# EAGLE design Touch_Shield-v20 (EAGLE 6.2)
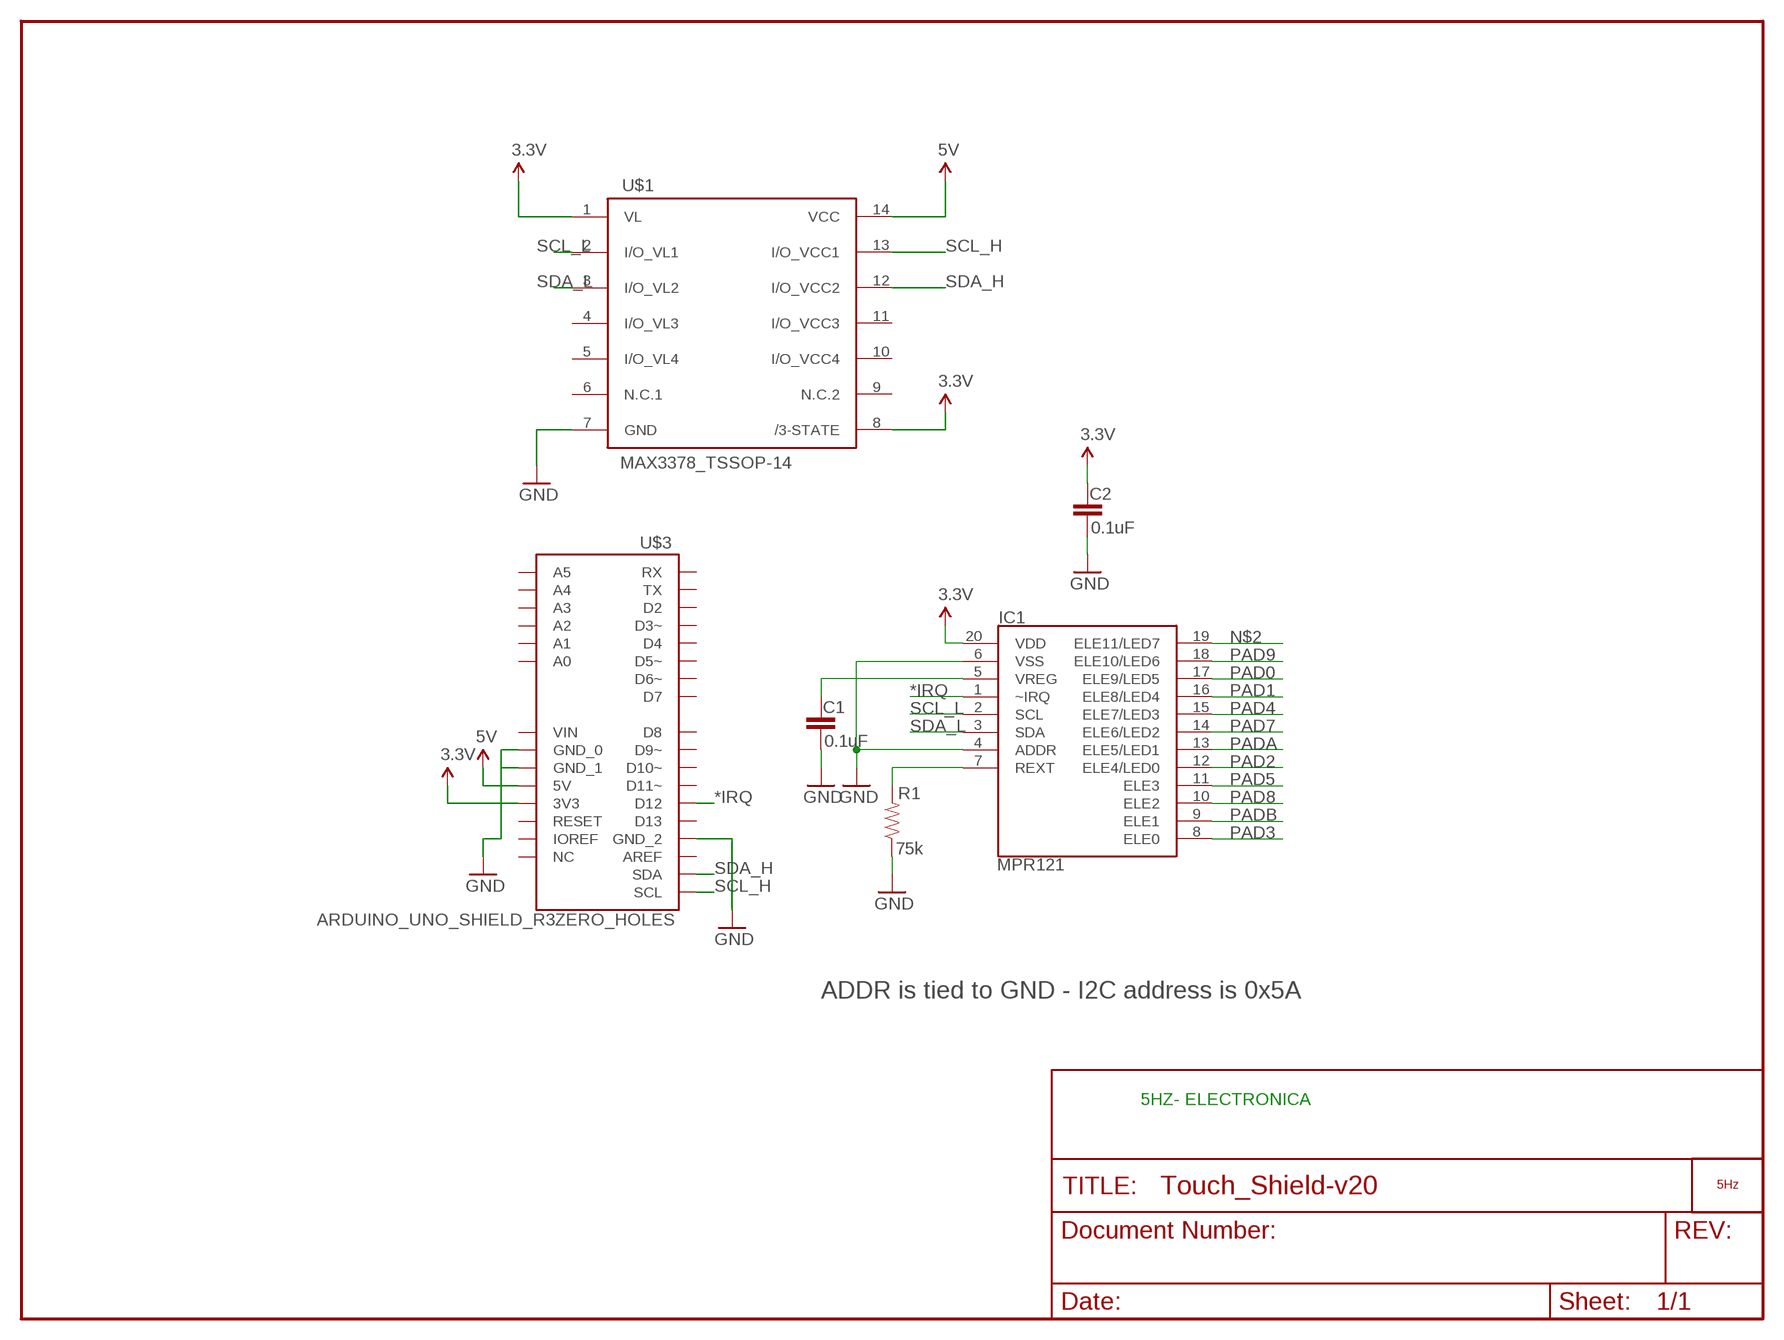
[diagram p0: schematic, sheet 1]

## Parts
C1  0.1uF  CAP0402-CAP  [0402-CAP]
C2  0.1uF  CAP0402-CAP  [0402-CAP]
IC1  MPR121  MPR121QFN20  [QFN-20-0.4MM]
LOGO1  LOGO_5HZ_H_10MM  [5HZ_LOGO_H_10MM]
R1  75k  RESISTOR0402-RES  [0402-RES]
U$1  MAX3378_TSSOP-14  [TSSOP14]
U$3  ARDUINO_UNO_SHIELD_R3ZERO_HOLES  [UNO_R3_SHIELD_NO_SILK]

## Nets
3.3V: C2.1 IC1.20(VDD) U$1.1(VL) U$1.8(/3-STATE) U$3.3.3V(3V3)
5V: U$1.14(VCC) U$3.5V
*IRQ: IC1.1(~IRQ) U$3.D12
GND: C1.2 C2.2 IC1.4(ADDR) IC1.6(VSS) R1.1 U$1.7(GND) U$3.GND_0 U$3.GND_1 U$3.GND_2
N$2: IC1.19(ELE11/LED7)
PAD0: IC1.17(ELE9/LED5)
PAD1: IC1.16(ELE8/LED4)
PAD2: IC1.12(ELE4/LED0)
PAD3: IC1.8(ELE0)
PAD4: IC1.15(ELE7/LED3)
PAD5: IC1.11(ELE3)
PAD7: IC1.14(ELE6/LED2)
PAD8: IC1.10(ELE2)
PAD9: IC1.18(ELE10/LED6)
PADA: IC1.13(ELE5/LED1)
PADB: IC1.9(ELE1)
REXT: IC1.7(REXT) R1.2
SCL_H: U$1.13(I/O_VCC1) U$3.SCL
SCL_L: IC1.2(SCL) U$1.2(I/O_VL1)
SDA_H: U$1.12(I/O_VCC2) U$3.SDA
SDA_L: IC1.3(SDA) U$1.3(I/O_VL2)
VREG: C1.1 IC1.5(VREG)
Unconnected: U$1.4(I/O_VL3) U$1.5(I/O_VL4) U$1.6(N.C.1) U$1.9(N.C.2) U$1.10(I/O_VCC4) U$1.11(I/O_VCC3) U$3.A0 U$3.A1 U$3.A2 U$3.A3 U$3.A4 U$3.A5 U$3.AREF U$3.D2 U$3.D3(D3~) U$3.D4 U$3.D5(D5~) U$3.D6(D6~) U$3.D7 U$3.D8 U$3.D9(D9~) U$3.D10(D10~) U$3.D11(D11~) U$3.D13 U$3.IOREF U$3.NC U$3.RES(RESET) U$3.RX U$3.TX U$3.VIN

## Notes on the sheet
- ADDR is tied to GND - I2C address is 0x5A
- 5HZ- ELECTRONICA

## Library data of the parts
C1 C2 = SparkFun:CAP: Capacitor Standard 0603 ceramic capacitor, and 0.1" leaded capacitor.
IC1 = SparkFun:MPR121: MPR121 Capacitive Touch Sensor Controller
LOGO1 = 5hz-electronica:LOGO_5HZ: Logotipo 5Hz "según Pedro"
R1 = SparkFun:RESISTOR: Resistor Basic schematic elements and footprints for 0603, 1206, and PTH resistors.
U$1 = 5hz-electronica:MAX3378
U$3 = 5hz-electronica:ARDUINO_UNO_SHIELD_R3

## Board
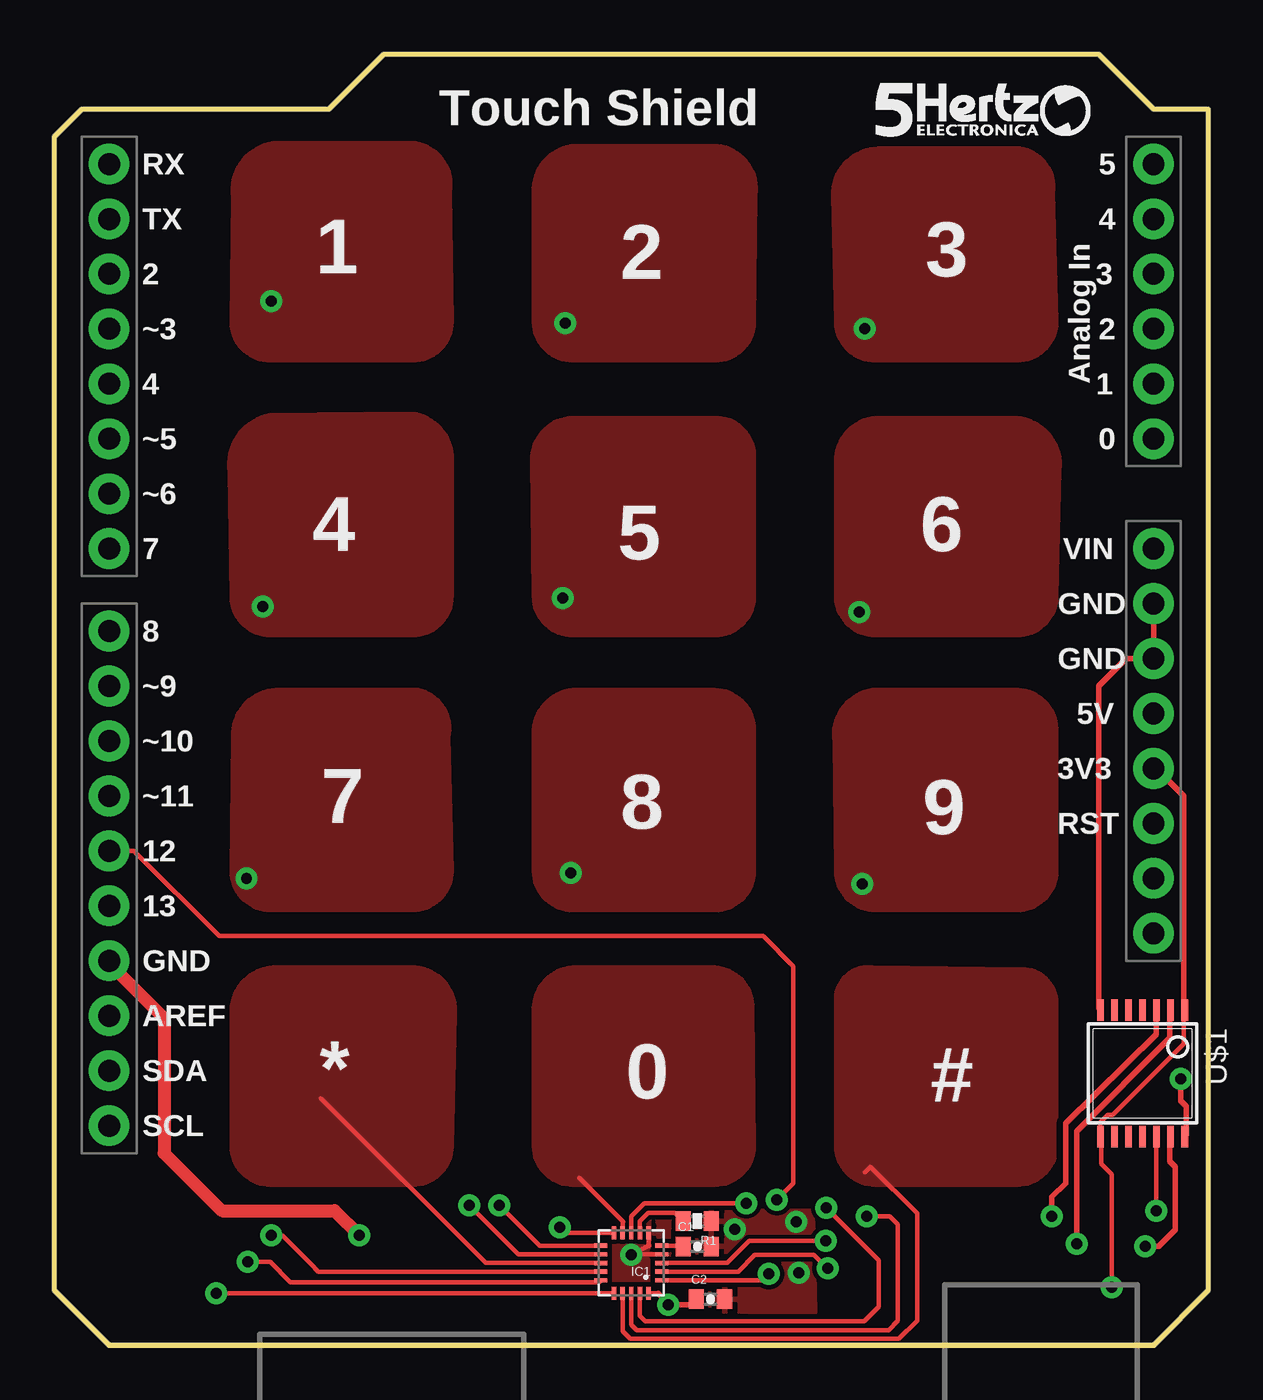
[diagram p1: board, top side]
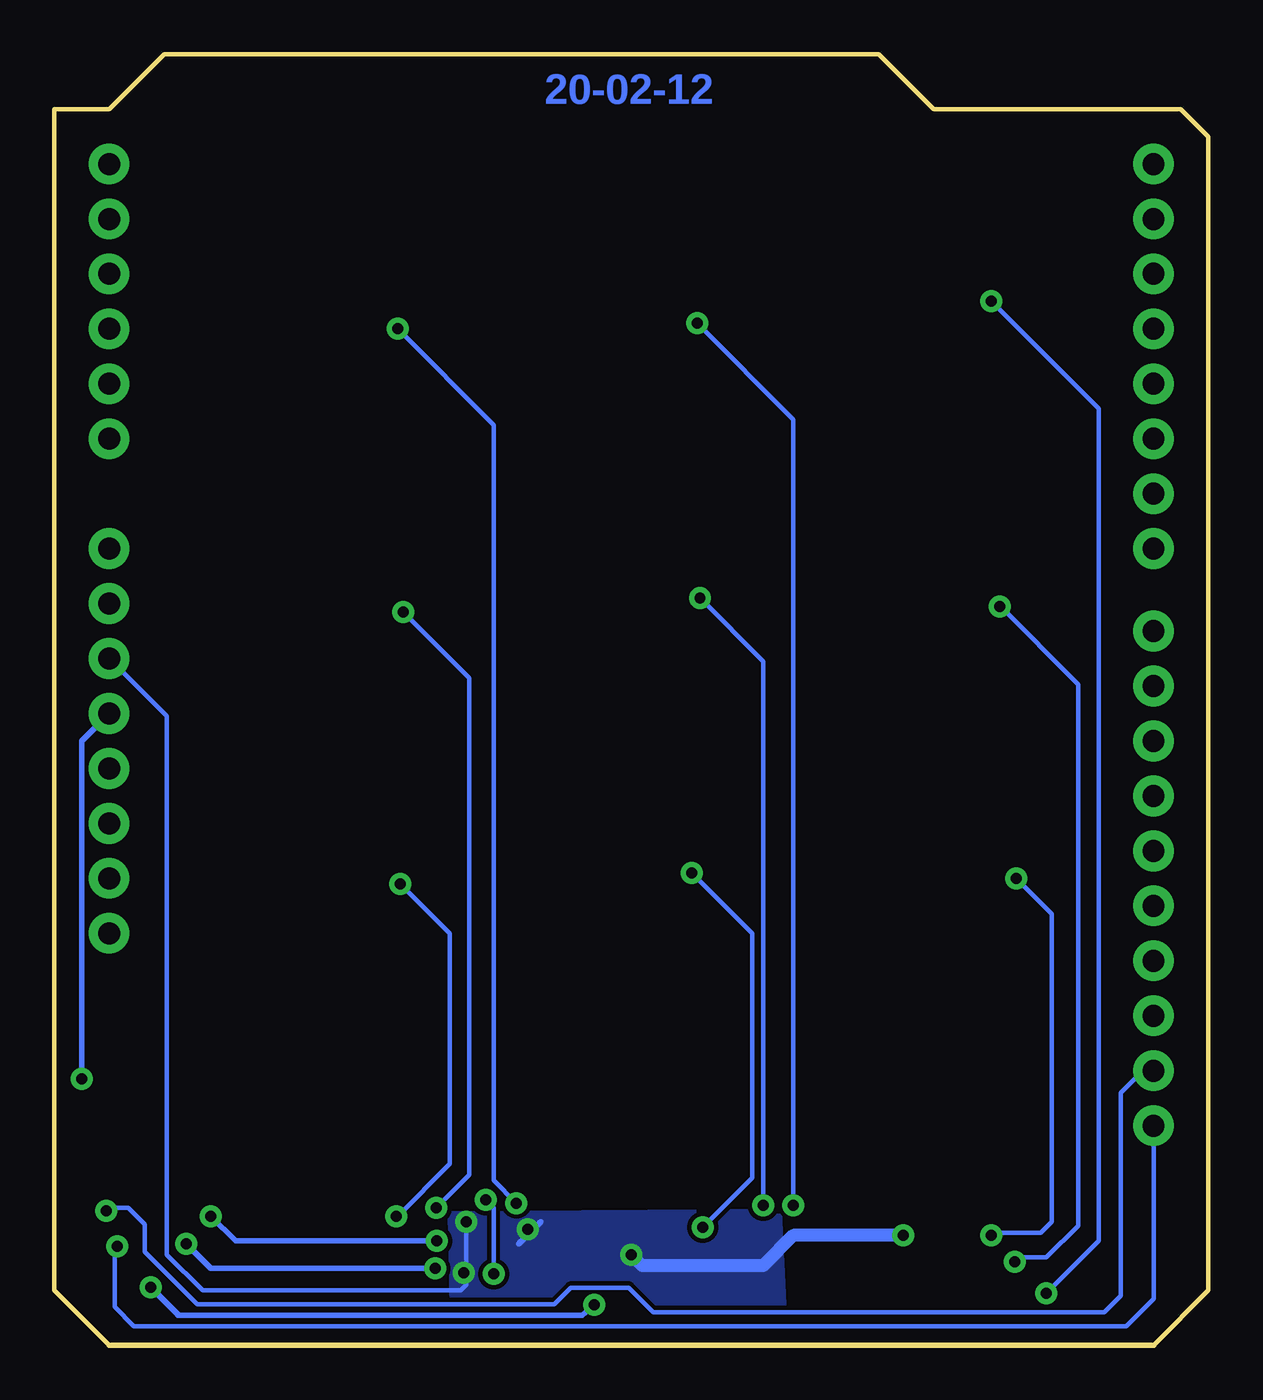
[diagram p2: board, bottom side, seen from below]

Size 53.34 x 59.69 mm. Coordinates in mm from the lower left corner, seen from the top.
Outline: 2.54,0 0,2.54 0,55.88 1.27,57.15 12.7,57.15 15.24,59.69 48.26,59.69 50.8,57.15 53.34,57.15 53.34,2.54 50.8,0 2.54,0
Copper layers (1*16): Top 0.035mm / dielectric 1.5mm / Bottom 0.035mm
Design rules: minimum track width 8mil, minimum drill 20mil, track to track 8mil, track to pad 8mil, pad to pad 8mil, via to via 8mil, smd to smd 8mil, copper to edge 10mil, drill to drill 8mil, minimum pad ring 12mil, minimum via ring 10mil, stop-mask expansion 4mil, vias tented up to drill 25mil, thermal gap 10mil

### Footprints (pad centres in the part's own frame; a part is rotated, then mirrored left to right if it is on the bottom)
0402-CAP = smd 0.7 x 0.9: 1 -0.65,0; 2 0.65,0
QFN-20-0.4MM = smd 0.6 x 0.2: 1 -1.4,0.8; 2 -1.4,0.4; 3 -1.4,0; 4 -1.4,-0.4; 5 -1.4,-0.8; 11 1.4,-0.8; 12 1.4,-0.4; 13 1.4,0; 14 1.4,0.4; 15 1.4,0.8 | smd 0.2 x 0.6: 6 -0.8,-1.4; 7 -0.4,-1.4; 8 0,-1.4; 9 0.4,-1.4; 10 0.8,-1.4; 16 0.8,1.4; 17 0.4,1.4; 18 0,1.4; 19 -0.4,1.4; 20 -0.8,1.4
0402-RES = smd 0.7 x 0.9: 1 -0.65,0; 2 0.65,0
TSSOP14 = smd 0.305 x 0.991: 1 -1.95,-2.918; 2 -1.3,-2.918; 3 -0.65,-2.918; 4 0,-2.918; 5 0.65,-2.918; 6 1.3,-2.918; 7 1.95,-2.918; 8 1.95,2.918; 9 1.3,2.918; 10 0.65,2.918; 11 0,2.918; 12 -0.65,2.918; 13 -1.3,2.918; 14 -1.95,2.918
UNO_R3_SHIELD_NO_SILK = drill 1.016 pad 1.88: 3.3V 26.67,2.54; 5V 29.21,2.54; A0 41.91,2.54; A1 44.45,2.54; A2 46.99,2.54; A3 49.53,2.54; A4 52.07,2.54; A5 54.61,2.54; AREF 15.24,50.8; D2 49.53,50.8; D3 46.99,50.8; D4 44.45,50.8; D5 41.91,50.8; D6 39.37,50.8; D7 36.83,50.8; D8 33.02,50.8; D9 30.48,50.8; D10 27.94,50.8; D11 25.4,50.8; D12 22.86,50.8; D13 20.32,50.8; GND_0 34.29,2.54; GND_1 31.75,2.54; GND_2 17.78,50.8; IOREF 21.59,2.54; NC 19.05,2.54; RES 24.13,2.54; RX 54.61,50.8; SCL 10.16,50.8; SDA 12.7,50.8; TX 52.07,50.8; VIN 36.83,2.54

### Placement (x,y rotation side)
C1  29.72,4.57 0 top
C2  30.33,2.13 0 top
IC1  26.67,3.81 180 top
LOGO1  37.97,55.88 0 top
R1  29.72,5.74 180 top
U$1  50.29,12.57 180 top
U$3  53.34,0 90 top

### Tracks (layer width: path | path; a pad name or v marks a point on that pad's centre or on a via)
3.3V  (via drill 0.51)
  Top 0.203: v48.87,2.69 48.87,7.9 48.39,8.38 48.39,9.61 U$1.8 48.34,10.32 48.69,10.67 48.92,10.67 52.2,13.95 52.2,15.45 U$1.1 | IC1.20 27.92,2.41
  Top 0.254: U$3.3.3V 50.93,26.67 52.2,25.4 52.2,15.54 U$1.1 | 27.92,2.41 v28.37,1.88 29.42,1.88 C2.1
  Bottom 0.203: 47.62,1.4 47.62,1.45
  Bottom 0.254: 47.62,1.4 28.93,1.4 v28.37,1.88 | 47.62,1.45 v48.87,2.69
5V  (via drill 0.51)
  Top 0.254: v52.07,12.32 52.07,11.3 52.32,11.05 52.32,9.74 U$1.14
  Bottom 0.254: U$3.5V 52.07,27.94 v52.07,12.32
*IRQ  (via drill 0.51)
  Top 0.203: U$3.D12 3.68,22.86 7.62,18.92 32.77,18.92 34.16,17.53 34.16,7.49 v33.4,6.73 | IC1.1 32.73,3.01 v33.02,3.3
  Bottom 0.203: v33.02,3.3 33.02,6.35 v33.4,6.73
GND  (via drill 0.51)
  Top 0.203: 27.07,4.21 IC1.4 | 27.47,4.61 IC1.6
  Top 0.254: U$3.GND_0 U$3.GND_1 49.53,31.75 48.26,30.48 48.26,15.57 U$1.7 | 27.07,4.21 v26.67,4.19 27.47,4.61
  Top 0.61: U$3.GND_2 2.54,17.65 5.08,15.11 5.08,8.89 7.75,6.22 12.95,6.22 v14.1,5.08
  Bottom 0.203: v34.29,5.71 34.29,2.79 34.54,2.54 46.48,2.54 48.13,4.19 48.13,29.08 U$3.GND_1
  Bottom 0.254: 30.86,5.71 31.88,4.7
  Bottom 0.61: v14.1,5.08 19.18,5.08 20.57,3.68 26.16,3.68 v26.67,4.19
  other vias: 31.45,5.36 34.42,3.35
  pour Top: 19.94,6.22 35.05,6.22 35.18,1.52 19.68,1.65
  pour Bottom: 19.81,6.22 35.05,6.1 34.98,1.75 19.61,1.88
PAD0
  Top 0.203: 37.47,8 37.72,8.26 39.88,6.1 39.88,1.14 39.04,0.3 26.62,0.3 26.27,0.65 IC1.17
  pour Top (isolate 0.305): 36.14,9.23 arc90 37.94,7.43 44.51,7.43 arc90 46.3,9.23 46.3,15.82 arc90 44.74,17.39 37.81,17.47 arc90 36.14,16.2
PAD1  (via drill 0.51)
  Top 0.203: IC1.16 v7.5,2.41 v7.49,2.41
  Bottom 0.203: v7.49,2.41 5.08,4.83 5.08,43.31 v10.03,48.26
  pour Top (isolate 0.305): 8.2,47.33 arc90 10,45.53 16.57,45.53 arc90 18.36,47.33 18.29,53.31 arc90 16.69,55.57 10.13,55.57 arc90 8.28,53.08
PAD2  (via drill 0.51)
  Top 0.203: IC1.12 21.44,4.21 v19.18,6.48
  Bottom 0.203: v19.18,6.48 19.18,42.8 v23.62,47.24
  pour Top (isolate 0.305): 22.17,47.33 arc90 23.97,45.53 30.54,45.53 arc90 32.33,47.33 32.41,53.16 arc90 30.66,55.44 24.1,55.44 arc90 22.17,53.31
PAD3  (via drill 0.51)
  Top 0.203: IC1.8 26.67,5.97 27.28,6.58 v31.98,6.58
  Bottom 0.203: v31.98,6.58 33.02,7.62 33.02,42.55 v37.47,46.99
  pour Top (isolate 0.305): 36.14,47.33 arc90 37.94,45.53 44.51,45.53 arc90 46.3,47.33 46.15,53.31 arc90 44.63,55.31 38.07,55.31 arc90 35.99,53.16
PAD4  (via drill 0.51)
  Top 0.203: 25.15,2.97 25.23,2.97 IC1.15 25.18,2.92 10.92,2.92 9.98,3.86 v8.94,3.86
  Bottom 0.203: v8.94,3.86 8.74,4.06 7.49,4.06 6.02,5.54 6.02,30.56 9.68,34.21 9.68,34.19 v9.65,34.16
  pour Top (isolate 0.305): 8.2,34.63 arc90 10,32.83 16.57,32.83 arc90 18.36,34.63 18.36,40.77 arc90 16.49,43.07 10,42.99 arc90 8.13,40.38
PAD5  (via drill 0.51)
  Top 0.203: IC1.11 22.44,4.61 v20.57,6.48
  Bottom 0.203: v20.57,6.48 20.57,31.62 v23.5,34.54
  pour Top (isolate 0.305): 22.17,34.63 arc90 23.97,32.83 30.54,32.83 arc90 32.33,34.63 32.33,41.15 arc90 30.54,42.87 23.97,42.87 arc90 22.1,40.92
PAD6  (via drill 0.51)
  Top 0.203: v35.69,6.35 38.1,3.94 38.1,1.78 37.44,1.12 27.3,1.12 27.05,1.37 27.05,2.41
  Bottom 0.203: v37.21,33.91 34.16,30.86 34.16,7.87 v35.69,6.35 35.43,6.35
  pour Top (isolate 0.305): 36.14,34.63 arc90 37.94,32.83 44.51,32.83 arc90 46.3,34.63 46.46,40.46 arc90 44.51,42.87 37.94,42.87 arc90 36.14,40.69
PAD7  (via drill 0.51)
  Top 0.203: v10.03,5.08 10.54,5.08 11.87,3.75 12.19,3.43 12.21,3.41 IC1.14
  Bottom 0.203: v8.89,21.59 7.24,19.94 7.24,5.71 7.75,5.21 9.91,5.21 v10.03,5.08
  pour Top (isolate 0.305): 8.2,21.93 arc90 10,20.13 16.57,20.13 arc90 18.36,21.93 18.21,28.14 arc90 16.82,30.29 10.25,30.29 arc90 8.28,28.14
PAD8  (via drill 0.51)
  Top 0.203: 25.4,5.21 IC1.10 | IC1.10 25.4,5.21 | 25.4,5.21 23.62,5.21 v23.37,5.46
  Bottom 0.203: v23.37,5.46 21.08,7.75 21.08,19.05 v23.88,21.84
  pour Top (isolate 0.305): 22.17,21.93 arc90 23.97,20.13 30.54,20.13 arc90 32.33,21.93 32.33,28.45 arc90 30.54,30.29 23.97,30.29 arc90 22.17,28.07
PAD9  (via drill 0.51)
  Top 0.203: IC1.18 26.67,0.96 26.92,0.71 38.56,0.71 38.99,1.14 38.99,5.59 38.61,5.97 v37.54,5.97
  Bottom 0.203: v37.34,21.34 35.05,19.05 35.05,8.38 37.47,5.97 v37.54,5.97
  pour Top (isolate 0.305): 36.14,21.93 arc90 37.94,20.13 44.51,20.13 arc90 46.3,21.93 46.3,28.52 arc90 44.38,30.29 37.81,30.29 arc90 36.07,27.91
PADA
  Top 0.203: IC1.13 19.94,3.81 12.32,11.43
  pour Top (isolate 0.305): 8.2,9.23 arc90 10,7.43 16.57,7.43 arc90 18.36,9.23 18.52,15.29 arc90 16.69,17.47 10.13,17.47 arc90 8.2,15.29
PADB
  Top 0.203: 24.26,7.75 26.29,5.71 26.27,5.7 IC1.9
  pour Top (isolate 0.305): 22.17,9.23 arc90 23.97,7.43 30.54,7.43 arc90 32.33,9.23 32.26,15.52 arc90 30.54,17.47 23.97,17.47 arc90 22.17,15.37
REXT
  Top 0.203: R1.2 28.69,6.12 27.46,6.12 27.07,5.73 IC1.7
SCL_H  (via drill 0.51)
  Top 0.254: v50.42,4.57 51.05,4.57 51.82,5.33 51.82,8.26 51.56,8.51 51.56,9.62 U$1.13
  Bottom 0.203: U$3.SCL 2.54,2.16 3.81,0.89 49.66,0.89 50.55,1.78 50.55,4.45 v50.42,4.57
SCL_L  (via drill 0.51)
  Top 0.203: IC1.2 31.6,3.41 32.38,4.19 35.1,4.19 v35.74,3.56
  Top 0.254: U$1.2 51.56,15.46 51.56,14.22 47.24,9.91 v47.24,4.7
  Bottom 0.254: v35.74,3.56 46.1,3.56 v47.24,4.7
SDA_H  (via drill 0.51)
  Top 0.203: v50.93,6.22 50.93,9.64 U$1.12
  Bottom 0.203: U$3.SDA 3.05,12.7 4.06,11.68 4.06,2.29 4.83,1.52 25.65,1.52 26.8,2.67 29.46,2.67 30.23,1.91 46.74,1.91 49.15,4.32 49.15,5.59 49.91,6.35 50.8,6.35 v50.93,6.22
SDA_L  (via drill 0.51)
  Top 0.203: IC1.3 31.11,3.81 32.13,4.83 v35.66,4.83
  Top 0.254: U$1.3 50.93,15.48 50.93,14.38 46.74,10.26 46.74,7.49 46.1,6.86 v46.1,5.97
  Bottom 0.254: v35.66,4.83 44.96,4.83 v46.1,5.97
VREG
  Top 0.203: 29.03,4.61 IC1.5
  Top 0.254: C1.1 29.03,4.61

### Text on the board
Bottom: 20-02-12
tPlace: Touch Shield | RX | 5 | TX | 4 | 1 | 2 | 2 | 3 | 3 | ~3 | 2 | 4 | Analog In | 1 | ~5 | 0 | ~6 | 4 | 6 | 7 | 5 | VIN | GND | 8 | GND | ~9 | 5V | ~10 | 3V3 | ~11 | 7 | 8 | 9 | RST | 12 | 13 | GND | AREF | SDA | * | 0 | # | SCL